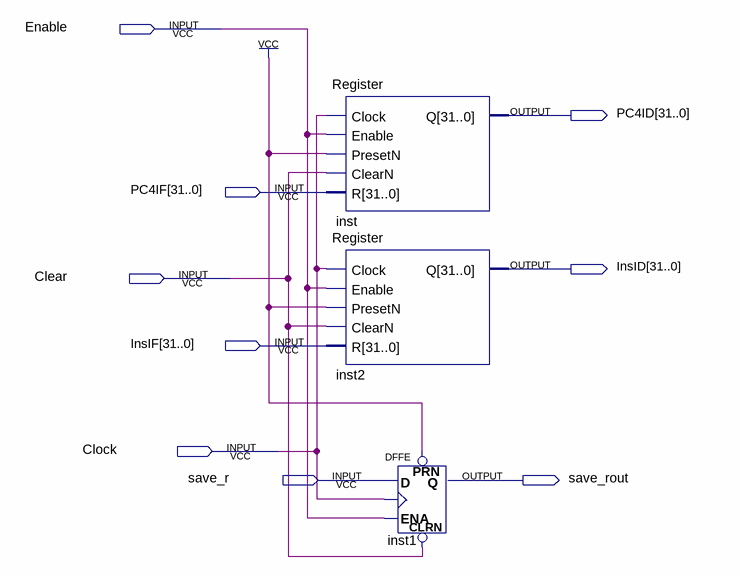
[diagram p0: schematic sheet]
// Quartus schematic BarreiraIFID_2.bdf as structural Verilog: 3 symbols, 9 pins
module BarreiraIFID_2 (
  input  Enable,
  input  [31:0] PC4IF,
  input  Clear,
  input  [31:0] InsIF,
  input  Clock,
  input  save_r,
  output [31:0] PC4ID,
  output [31:0] InsID,
  output save_rout
);

  Register inst (.Clock(Clock), .Enable(Enable), .PresetN(1'b1), .ClearN(Clear), .R(PC4IF), .Q(PC4ID));
  Register inst2 (.Clock(Clock), .Enable(Enable), .PresetN(1'b1), .ClearN(Clear), .R(InsIF), .Q(InsID));
  DFFE inst1 (.PRN(1'b1), .CLRN(Clear), .D(save_r), .CLK(Clock), .ENA(Enable), .Q(save_rout));
endmodule
